# Altium schematic sheet MCU.SchDoc
size 330 x 220 mm
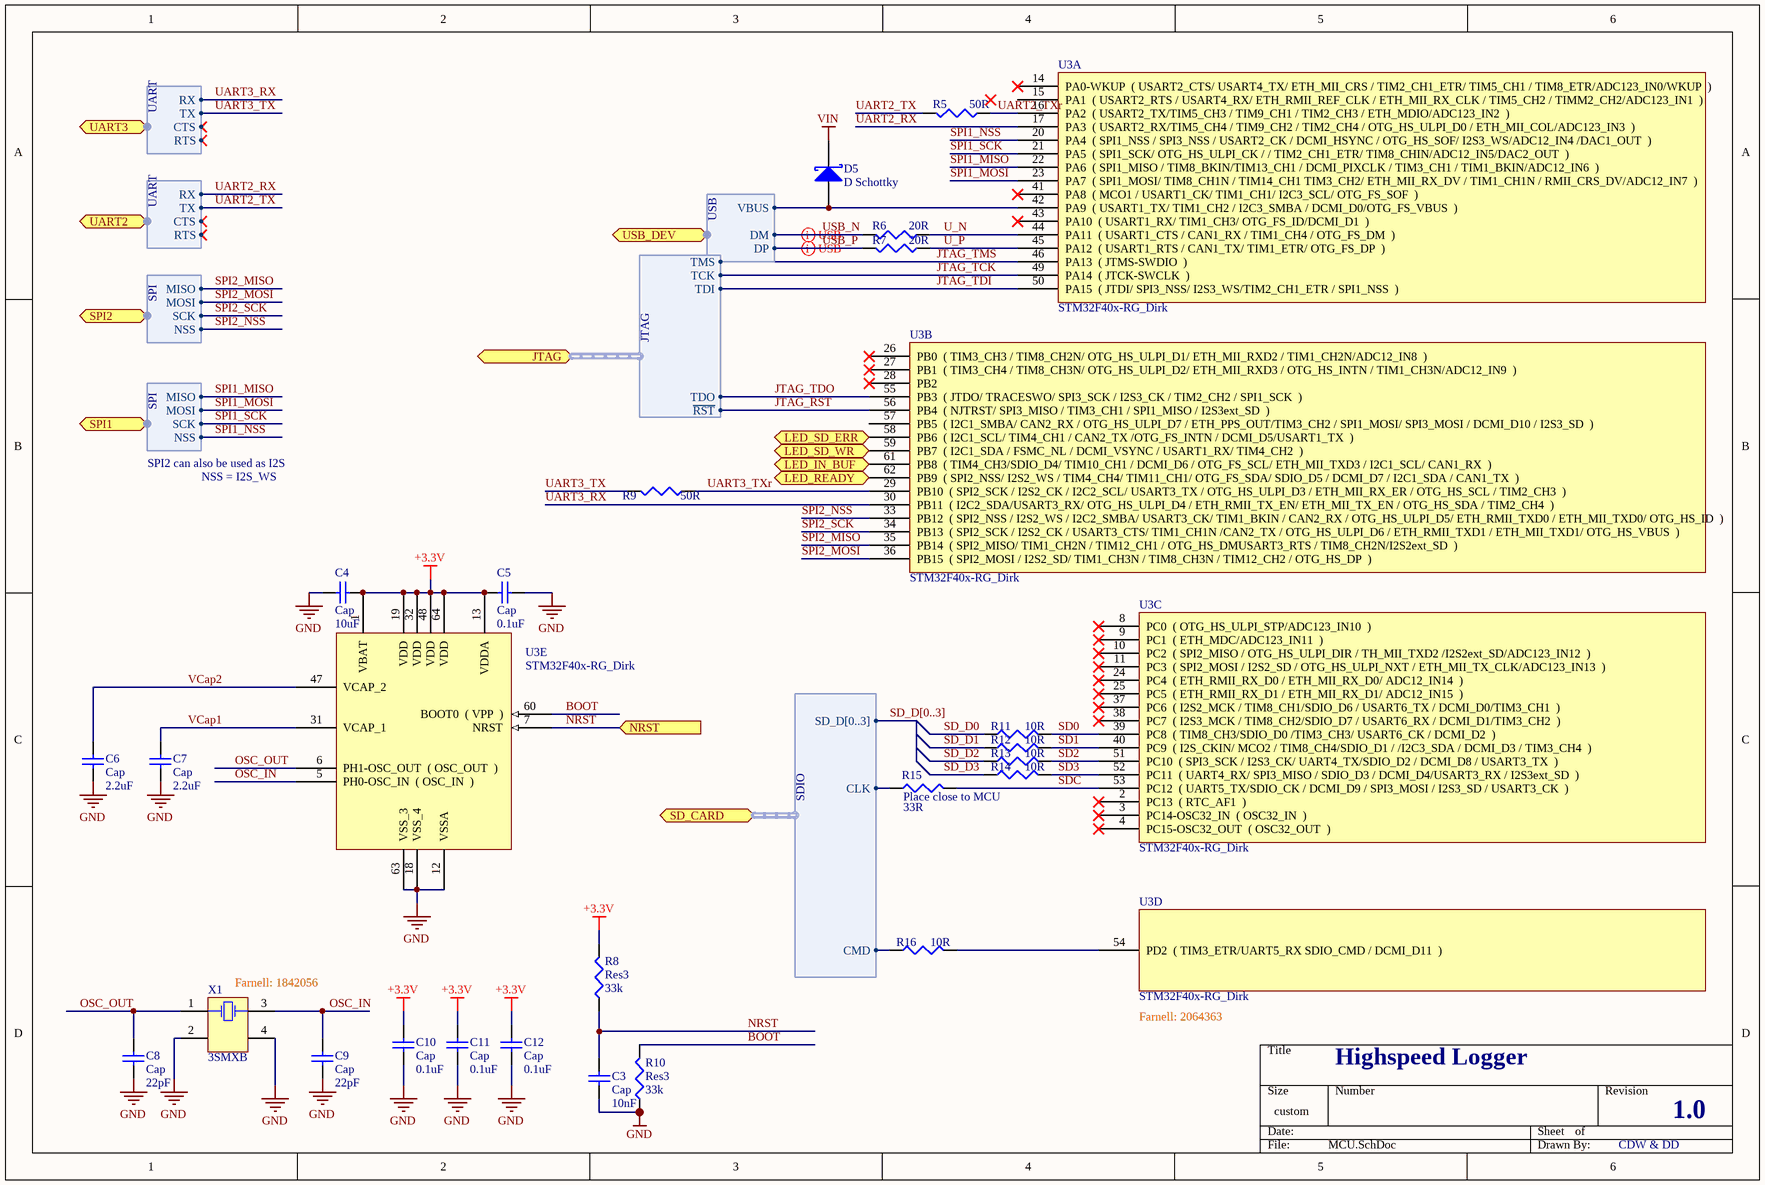
[diagram p0: MCU.SchDoc]

## Parts
C3  Cap  value 10nF  [V0402]
C4  Cap  value 10uF  [V0603]
C5  Cap  value 0.1uF  [V0402]
C6  Cap  value 2.2uF  [V0402]
C7  Cap  value 2.2uF  [V0402]
C8  Cap  value 22pF  [V0402]
C9  Cap  value 22pF  [V0402]
C10  Cap  value 0.1uF  [V0402]
C11  Cap  value 0.1uF  [V0402]
C12  Cap  value 0.1uF  [V0402]
D5  D Schottky  [SOD-323]
R5  value 50R  [V0402RES]  (hidden comment: Res3)
R6  value 20R  [V0402RES]  (hidden comment: Res3)
R7  value 20R  [V0402RES]  (hidden comment: Res3)
R8  Res3  value 33k  [V0402RES]
R9  value 50R  [V0402RES]  (hidden comment: Res3)
R10  Res3  value 33k  [V0402RES]
R11  value 10R  [V0402RES]  (hidden comment: Place close to MCU)
R12  value 10R  [V0402RES]  (hidden comment: Place close to MCU)
R13  value 10R  [V0402RES]  (hidden comment: Place close to MCU)
R14  value 10R  [V0402RES]  (hidden comment: Place close to MCU)
R15  Place close to MCU  value 33R  [V0402RES]
R16  value 10R  [V0402RES]  (hidden comment: Place close to MCU)
U3  STM32F40x-RG_Dirk  [LQFP64]  (parts A,B,C,D,E of 5)
X1  3SMXB  Farnell: 1842056  [CFPX-5]

## Ports
JTAG (harness JTAG), LED_IN_BUF, LED_READY (out), LED_SD_ERR (out), LED_SD_WR (out), NRST (in), SD_CARD (harness SDIO), SPI1 (harness SPI), SPI2 (harness SPI), UART2 (harness UART), UART3 (harness UART), USB_DEV (harness USB)

## Harnesses
UART: RX, TX, CTS, RTS
SPI: MISO, MOSI, SCK, NSS
SDIO: SD_D[0..3], CLK, CMD
USB: VBUS, DM, DP
JTAG: ~{RST}, TCK, TDI, TDO, TMS

## Nets
+3.3V: C4.1 C5.2 C10.2 C11.2 C12.2 R8.2 U3.1(VBAT) U3.13(VDDA) U3.19(VDD) U3.32(VDD) U3.48(VDD) U3.64(VDD)
GND: C3.1 C4.2 C5.1 C6.1 C7.1 C8.1 C9.2 C10.1 C11.1 C12.1 R10.1 U3.12(VSSA) U3.18(VSS_4) U3.63(VSS_3) X1.2(NC) X1.4(NC)
VIN: D5.2(K)
BOOT: R10.2 U3.60(BOOT0__(_VPP__))
JTAG_RST: U3.56(PB4__(_NJTRST/_SPI3_MISO_/_TIM3_CH1_/_SPI1_MISO_/_I2S3ext_SD__)) ; port JTAG.~{RST}
JTAG_TCK: U3.49(PA14__(_JTCK-SWCLK__)) ; port JTAG.TCK
JTAG_TDI: U3.50(PA15__(_JTDI/_SPI3_NSS/_I2S3_WS/TIM2_CH1_ETR_/_SPI1_NSS__)) ; port JTAG.TDI
JTAG_TDO: U3.55(PB3__(_JTDO/_TRACESWO/_SPI3_SCK_/_I2S3_CK_/_TIM2_CH2_/_SPI1_SCK__)) ; port JTAG.TDO
JTAG_TMS: U3.46(PA13__(_JTMS-SWDIO__)) ; port JTAG.TMS
LED_IN_BUF: U3.61(PB8__(_TIM4_CH3/SDIO_D4/_TIM10_CH1_/_DCMI_D6_/_OTG_FS_SCL/_ETH_MII_TXD3_/_I2C1_SCL/_CAN1_RX__)) ; port LED_IN_BUF
LED_READY: U3.62(PB9__(_SPI2_NSS/_I2S2_WS_/_TIM4_CH4/_TIM11_CH1/_OTG_FS_SDA/_SDIO_D5_/_DCMI_D7_/_I2C1_SDA_/_CAN1_TX__)) ; port LED_READY
LED_SD_ERR: U3.58(PB6__(_I2C1_SCL/_TIM4_CH1_/_CAN2_TX_/OTG_FS_INTN_/_DCMI_D5/USART1_TX__)) ; port LED_SD_ERR
LED_SD_WR: U3.59(PB7__(_I2C1_SDA_/_FSMC_NL_/_DCMI_VSYNC_/_USART1_RX/_TIM4_CH2__)) ; port LED_SD_WR
NRST: C3.2 R8.1 U3.7(NRST) ; port NRST
OSC_IN: C9.1 U3.5(PH0-OSC_IN__(_OSC_IN__)) X1.3(OSC2)
OSC_OUT: C8.2 U3.6(PH1-OSC_OUT__(_OSC_OUT__)) X1.1(OSC1)
SD0: R11.2 U3.39(PC8__(_TIM8_CH3/SDIO_D0_/TIM3_CH3/_USART6_CK_/_DCMI_D2__))
SD1: R12.2 U3.40(PC9__(_I2S_CKIN/_MCO2_/_TIM8_CH4/SDIO_D1_/_/I2C3_SDA_/_DCMI_D3_/_TIM3_CH4__))
SD2: R13.2 U3.51(PC10__(_SPI3_SCK_/_I2S3_CK/_UART4_TX/SDIO_D2_/_DCMI_D8_/_USART3_TX__))
SD3: R14.2 U3.52(PC11__(_UART4_RX/_SPI3_MISO_/_SDIO_D3_/_DCMI_D4/USART3_RX_/_I2S3ext_SD__))
SD_D0: R11.1
SD_D1: R12.1
SD_D2: R13.1
SD_D3: R14.1
SDC: R15.2 U3.53(PC12__(_UART5_TX/SDIO_CK_/_DCMI_D9_/_SPI3_MOSI_/_I2S3_SD_/_USART3_CK__))
SPI1_MISO: U3.22(PA6__(_SPI1_MISO_/_TIM8_BKIN/TIM13_CH1_/_DCMI_PIXCLK_/_TIM3_CH1_/_TIM1_BKIN/ADC12_IN6__)) ; port SPI1.MISO
SPI1_MOSI: U3.23(PA7__(_SPI1_MOSI/_TIM8_CH1N_/_TIM14_CH1_TIM3_CH2/_ETH_MII_RX_DV_/_TIM1_CH1N_/_RMII_CRS_DV/ADC12_IN7__)) ; port SPI1.MOSI
SPI1_NSS: U3.20(PA4__(_SPI1_NSS_/_SPI3_NSS_/_USART2_CK_/_DCMI_HSYNC_/_OTG_HS_SOF/_I2S3_WS/ADC12_IN4_/DAC1_OUT__)) ; port SPI1.NSS
SPI1_SCK: U3.21(PA5__(_SPI1_SCK/_OTG_HS_ULPI_CK_/_/_TIM2_CH1_ETR/_TIM8_CHIN/ADC12_IN5/DAC2_OUT__)) ; port SPI1.SCK
SPI2_MISO: U3.35(PB14__(_SPI2_MISO/_TIM1_CH2N_/_TIM12_CH1_/_OTG_HS_DMUSART3_RTS_/_TIM8_CH2N/I2S2ext_SD__)) ; port SPI2.MISO
SPI2_MOSI: U3.36(PB15__(_SPI2_MOSI_/_I2S2_SD/_TIM1_CH3N_/_TIM8_CH3N_/_TIM12_CH2_/_OTG_HS_DP__)) ; port SPI2.MOSI
SPI2_NSS: U3.33(PB12__(_SPI2_NSS_/_I2S2_WS_/_I2C2_SMBA/_USART3_CK/_TIM1_BKIN_/_CAN2_RX_/_OTG_HS_ULPI_D5/_ETH_RMII_TXD0_/_ETH_MII_TXD0/_OTG_HS_ID__)) ; port SPI2.NSS
SPI2_SCK: U3.34(PB13__(_SPI2_SCK_/_I2S2_CK_/_USART3_CTS/_TIM1_CH1N_/CAN2_TX_/_OTG_HS_ULPI_D6_/_ETH_RMII_TXD1_/_ETH_MII_TXD1/_OTG_HS_VBUS__)) ; port SPI2.SCK
U_N: R6.1 U3.44(PA11__(_USART1_CTS_/_CAN1_RX_/_TIM1_CH4_/_OTG_FS_DM__))
U_P: R7.1 U3.45(PA12__(_USART1_RTS_/_CAN1_TX/_TIM1_ETR/_OTG_FS_DP__))
UART2_RX: U3.17(PA3__(_USART2_RX/TIM5_CH4_/_TIM9_CH2_/_TIM2_CH4_/_OTG_HS_ULPI_D0_/_ETH_MII_COL/ADC123_IN3__)) ; port UART2.RX
UART2_TX: R5.2 ; port UART2.TX
UART2_TXr: R5.1 U3.16(PA2__(_USART2_TX/TIM5_CH3_/_TIM9_CH1_/_TIM2_CH3_/_ETH_MDIO/ADC123_IN2__))
UART3_RX: U3.30(PB11__(_I2C2_SDA/USART3_RX/_OTG_HS_ULPI_D4_/_ETH_RMII_TX_EN/_ETH_MII_TX_EN_/_OTG_HS_SDA_/_TIM2_CH4__)) ; port UART3.RX
UART3_TX: R9.2 ; port UART3.TX
UART3_TXr: R9.1 U3.29(PB10__(_SPI2_SCK_/_I2S2_CK_/_I2C2_SCL/_USART3_TX_/_OTG_HS_ULPI_D3_/_ETH_MII_RX_ER_/_OTG_HS_SCL_/_TIM2_CH3__))
USB_N: R6.2 ; port USB_DEV.DM
USB_P: R7.2 ; port USB_DEV.DP
VCap1: C7.2 U3.31(VCAP_1)
VCap2: C6.2 U3.47(VCAP_2)
NetD5_1: D5.1(A) U3.42(PA9__(_USART1_TX/_TIM1_CH2_/_I2C3_SMBA_/_DCMI_D0/OTG_FS_VBUS__)) ; port USB_DEV.VBUS
NetR15_1: R15.1 ; port SD_CARD.CLK
NetR16_1: R16.1 ; port SD_CARD.CMD
NetR16_2: R16.2 U3.54(PD2__(_TIM3_ETR/UART5_RX_SDIO_CMD_/_DCMI_D11__))

Not connected (* = marked no-connect by the designer): U3 2(PC13__(_RTC_AF1__))* 3(PC14-OSC32_IN__(_OSC32_IN__))* 4(PC15-OSC32_OUT__(_OSC32_OUT__))* 8(PC0__(_OTG_HS_ULPI_STP/ADC123_IN10__))* 9(PC1__(_ETH_MDC/ADC123_IN11__))* 10(PC2__(_SPI2_MISO_/_OTG_HS_ULPI_DIR_/_TH_MII_TXD2_/I2S2ext_SD/ADC123_IN12__))* 11(PC3__(_SPI2_MOSI_/_I2S2_SD_/_OTG_HS_ULPI_NXT_/_ETH_MII_TX_CLK/ADC123_IN13__))* 14(PA0-WKUP__(_USART2_CTS/_USART4_TX/_ETH_MII_CRS_/_TIM2_CH1_ETR/_TIM5_CH1_/_TIM8_ETR/ADC123_IN0/WKUP__))* 15(PA1__(_USART2_RTS_/_USART4_RX/_ETH_RMII_REF_CLK_/_ETH_MII_RX_CLK_/_TIM5_CH2_/_TIMM2_CH2/ADC123_IN1__)) 24(PC4__(_ETH_RMII_RX_D0_/_ETH_MII_RX_D0/_ADC12_IN14__))* 25(PC5__(_ETH_RMII_RX_D1_/_ETH_MII_RX_D1/_ADC12_IN15__))* 26(PB0__(_TIM3_CH3_/_TIM8_CH2N/_OTG_HS_ULPI_D1/_ETH_MII_RXD2_/_TIM1_CH2N/ADC12_IN8__))* 27(PB1__(_TIM3_CH4_/_TIM8_CH3N/_OTG_HS_ULPI_D2/_ETH_MII_RXD3_/_OTG_HS_INTN_/_TIM1_CH3N/ADC12_IN9__))* 28(PB2)* 37(PC6__(_I2S2_MCK_/_TIM8_CH1/SDIO_D6_/_USART6_TX_/_DCMI_D0/TIM3_CH1__))* 38(PC7__(_I2S3_MCK_/_TIM8_CH2/SDIO_D7_/_USART6_RX_/_DCMI_D1/TIM3_CH2__))* 41(PA8__(_MCO1_/_USART1_CK/_TIM1_CH1/_I2C3_SCL/_OTG_FS_SOF__))* 43(PA10__(_USART1_RX/_TIM1_CH3/_OTG_FS_ID/DCMI_D1__))* 57(PB5__(_I2C1_SMBA/_CAN2_RX_/_OTG_HS_ULPI_D7_/_ETH_PPS_OUT/TIM3_CH2_/_SPI1_MOSI/_SPI3_MOSI_/_DCMI_D10_/_I2S3_SD__))

## Buses and harness runs
bus SD_D[0..3]

## Layout directives
differential pair: USB_N, USB_P

## Notes on the sheet
- SPI2 can also be used as I2S
- NSS = I2S_WS
- Highspeed Logger
- 1.0
- CDW & DD

## Library data of the parts
C3-C12 = Cap: Capacitor; Published: 8-Jun-2000; LatestRevisionDate: 17-Jul-2002; LatestRevisionNote: Re-released for DXP Platform.; PackageReference: RAD-0.3; Publisher: Altium Limited; PackageDescription: Radial Cap, Thru-Hole; 2 Leads; 0.3 in Pin Spacing
D5 = D Schottky: Schottky Diode; Published: 8-Jun-2000; LatestRevisionDate: 17-Jul-2002; LatestRevisionNote: Re-released for DXP Platform.; PackageReference: SMB; Publisher: Altium Limited; PackageDescription: DO-214-AA/SMB; 2 C-Bend Leads; Body 5.3 x 3.6 mm, inc. leads (LxW); Code_JEDEC: DO-214-AA
R5-R16 = Res3: Resistor; Published: 8-Jun-2000; LatestRevisionDate: 29-May-2009; LatestRevisionNote: IPC-7351 Footprint Added.; PackageReference: J1-0603; Publisher: Altium Limited; PackageDescription: Chip Resistor
X1 = 3SMXB: Surface Mount Quartz Crystal; Note: PCB layout complies with manufacturer's recommendation.; Published: 17-Jul-2002; DatasheetDocument: 6-Apr-1998; PackageDocument: 6-Apr-1998; PackageReference: 3SMXB; Publisher: Altium Limited; ComponentLink1Description: Manufacturer Link; ComponentLink1URL: http://www.cmac.com/mt/; ComponentLink2Description: Datasheet; ComponentLink2URL: http://www.cmac.com/mt/databook/crystals/smd/3smx.pdf